# EAGLE schematic powersupply (EAGLE 9.6.2)
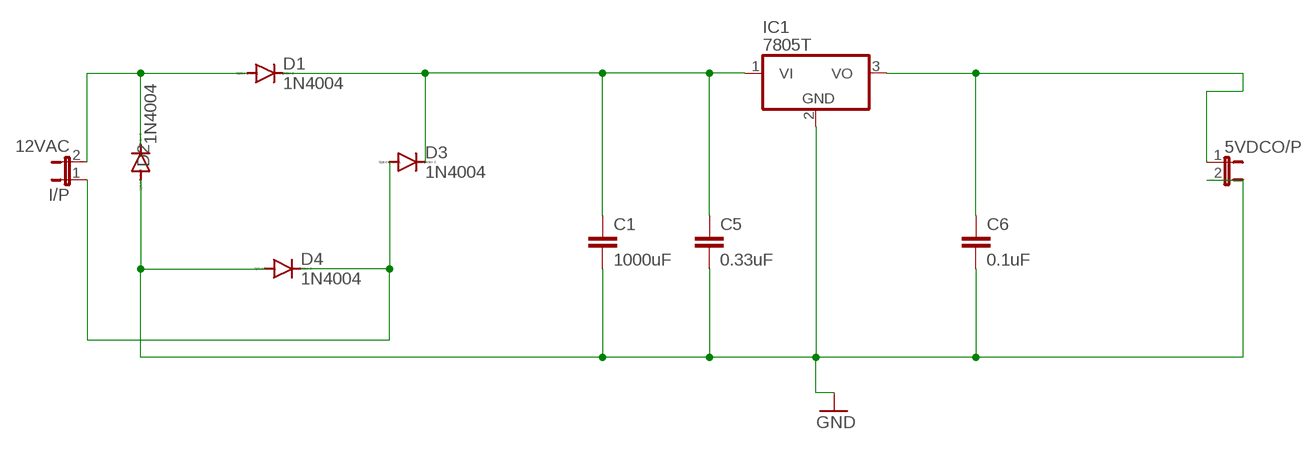
[diagram p0: schematic, sheet 1]

## Parts
5VDCO/P  JP1E  [JP1]
C1  1000uF  C2,5-3  [C2.5-3]
C5  0.33uF  C2,5-3  [C2.5-3]
C6  0.1uF  C2,5-3  [C2.5-3]
D1  1N4004  [DO41-10]
D2  1N4004  [DO41-10]
D3  1N4004  [DO41-10]
D4  1N4004  [DO41-10]
I/P  12VAC  JP1E  [JP1]
IC1  7805T  [TO220H]

## Nets
N$1: D1.A D2.C I/P.2
N$2: C1.1 C5.1 D1.C D3.C IC1.1(VI)
N$3: D3.A D4.C I/P.1
N$4: 5VDCO/P.2 C1.2 C5.2 C6.2 D2.A D4.A IC1.2(GND) ; supply symbol labelled GND
N$5: 5VDCO/P.1 C6.1 IC1.3(VO)

## Library data of the parts
5VDCO/P I/P = jumper:JP1E: JUMPER
C1 C5 C6 = capacitor-wima:C: CAPACITOR naming: grid - package width
D1-D4 = diode:1N4004: DIODE general purpose rectifier, 1 A
IC1 = linear:78*: Positive VOLTAGE REGULATOR Source: http://cache.national.com/ds/LM/LM78L05.pdf http://www.fairchildsemi.com/ds/LM/LM7805.pdf